# EAGLE design GalvShield_005 (EAGLE 7.1.0)
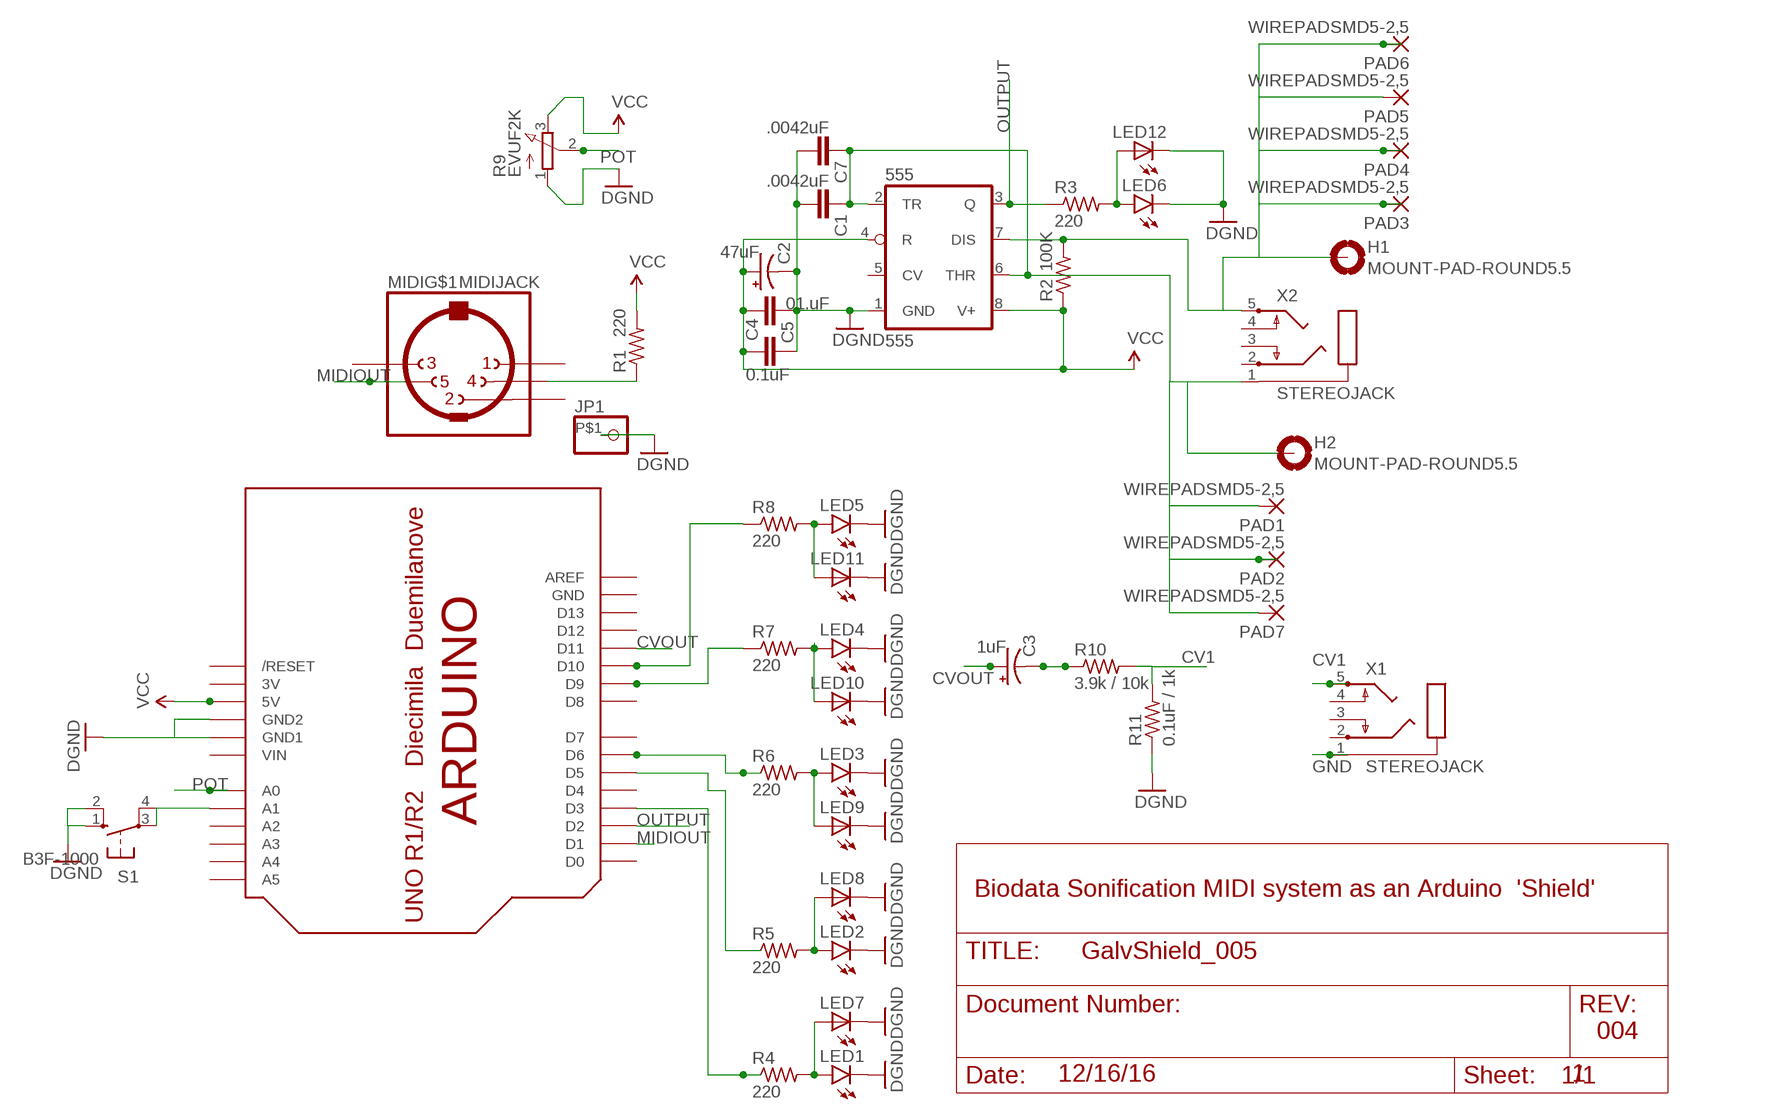
[diagram p0: schematic, sheet 1]

## Parts
555  555  LM555N  [DIL08-ROUND]
C1  .0042uF  CAPPTH  [CAP-PTH-SMALL]
C2  47uF  CAP_POLPTH2  [CPOL-RADIAL-10UF-25V]
C3  1uF  CAP_POLPTH2  [CPOL-RADIAL-10UF-25V]
C4  0.1uF  CAPPTH  [CAP-PTH-SMALL]
C5  01.uF  CAP1206  [1206]
C7  .0042uF  CAP1206  [1206]
H1  MOUNT-PAD-ROUND5.5  [5,5-PAD]
H2  MOUNT-PAD-ROUND5.5  [5,5-PAD]
JP1  PINHD-1X1-BIGPOGO  [1X1-BIGPOGO]
LED1  LED5MM  [LED5MM]
LED2  LED5MM  [LED5MM]
LED3  LED5MM  [LED5MM]
LED4  LED5MM  [LED5MM]
LED5  LED5MM  [LED5MM]
LED6  LED5MM  [LED5MM]
LED7  LEDSML1206  [SML1206]
LED8  LEDSML1206  [SML1206]
LED9  LEDSML1206  [SML1206]
LED10  LEDSML1206  [SML1206]
LED11  LEDSML1206  [SML1206]
LED12  LEDSML1206  [SML1206]
MIDI  MIDIJACK  [CP-2350]
PAD1  WIREPADSMD5-2,5  [5-2,5]
PAD2  WIREPADSMD5-2,5  [5-2,5]
PAD3  WIREPADSMD5-2,5  [5-2,5]
PAD4  WIREPADSMD5-2,5  [5-2,5]
PAD5  WIREPADSMD5-2,5  [5-2,5]
PAD6  WIREPADSMD5-2,5  [5-2,5]
PAD7  WIREPADSMD5-2,5  [5-2,5]
R1  220  R-US_FLIPFLOP7  [0805-THM-7]
R2  100K  R-US_FLIPFLOP7  [0805-THM-7]
R3  220  R-US_FLIPFLOP7  [0805-THM-7]
R4  220  R-US_FLIPFLOP7  [0805-THM-7]
R5  220  R-US_FLIPFLOP7  [0805-THM-7]
R6  220  R-US_FLIPFLOP7  [0805-THM-7]
R7  220  R-US_FLIPFLOP7  [0805-THM-7]
R8  220  R-US_FLIPFLOP7  [0805-THM-7]
R9  EVUF2K  [EVUFXK]
R10  3.9k / 10k  R-US_FLIPFLOP7  [0805-THM-7]
R11  0.1uF / 1k  R-US_FLIPFLOP7  [0805-THM-7]
S1  B3F-1000  10-XX  [B3F-10XX]
U$3  ARDUINOUNO  [ARDUINO]
X1  STEREOJACK  [STX3100]
X2  STEREOJACK  [STX3100]

## Nets
CV1: R10.2 R11.2 X1.5
CVOUT: C3.1(+) U$3.D11
GND: 555.1(GND) C1.2 C2.2(-) C4.2 C5.1 C7.2 JP1.P$1 LED1.K(C) LED2.K(C) LED3.K(C) LED4.K(C) LED5.K(C) LED6.K(C) LED7.C LED8.C LED9.C LED10.C LED11.C LED12.C R9.1(A) R11.1 S1.1(S) S1.2(S1) U$3.GND1 U$3.GND2 X1.1 ; supply symbol labelled DGND
MIDIOUT: MIDI.5 U$3.D1
N$1: C3.2(-) R10.1
N$2: S1.3(P) S1.4(P1) U$3.A1
N$3: R8.1 U$3.D10
N$4: R4.1 U$3.D3
N$5: R5.1 U$3.D5
N$6: MIDI.4 R1.1
N$7: R7.1 U$3.D9
N$10: R6.1 U$3.D6
N$16: LED1.A LED7.A R4.2
N$18: LED2.A LED8.A R5.2
N$19: LED3.A LED9.A R6.2
N$20: LED4.A LED10.A R7.2
N$21: LED5.A LED11.A R8.2
N$26: LED6.A LED12.A R3.2
OUTPUT: 555.3(Q) R3.1 U$3.D2
POT: R9.2(S) U$3.A0
PROBE1: 555.2(TR) 555.6(THR) C1.1 C7.1 H2.B5,5(MOUNT) PAD1.1(P) PAD2.1(P) PAD7.1(P) X2.1
PROBE2: 555.7(DIS) H1.B5,5(MOUNT) PAD3.1(P) PAD4.1(P) PAD5.1(P) PAD6.1(P) R2.2 X2.5
VCC: 555.4(R) 555.8(V+) C2.1(+) C4.1 C5.2 R1.2 R2.1 R9.3(E) U$3.5V
Unconnected: 555.5(CV) MIDI.1 MIDI.2 MIDI.3 MIDI.PE1(MT) MIDI.PE2(MT) MIDI.PE(MT) MIDI.PE@(MT) U$3.A2 U$3.A3 U$3.A4 U$3.A5 U$3.AREF U$3.D0 U$3.D4 U$3.D7 U$3.D8 U$3.D12 U$3.D13 U$3.RESET(/RESET) X1.2 X1.3 X1.4 X2.2 X2.3 X2.4

## Notes on the sheet
- Biodata Sonification MIDI system as an Arduino  'Shield'
- 004
- 12/16/16 | 1

## Power pins joined to a net without a drawn wire
3V: U$3.3V
GND: U$3.GND
VIN: U$3.VIN

## Library data of the parts
555 = adafruit:*555: TIMER Changed DIP package to have round (not oval) pin pads http://www.ladyada.net/library/pcb/eaglelibrary.html
C1 C5 C7 = SparkFun-Passives:CAP: Capacitor Standard 0603 ceramic capacitor, and 0.1" leaded capacitor.
C2 C3 = SparkFun-Passives:CAP_POL: Capacitor Polarized These are standard SMD and PTH capacitors. Normally 10uF, 47uF, and 100uF in electrolytic and tantalum varieties. Always verify the external diameter of the through hole cap, it varies with capacity, voltage, and manufacturer. The EIA devices should be standard.
C4 = SparkFun-Capacitors:CAP: Capacitor Standard 0603 ceramic capacitor, and 0.1" leaded capacitor.
H1 H2 = holes:MOUNT-PAD-ROUND: MOUNTING PAD, round
JP1 = adafruit:PINHD-1X1: Pin header 1x1 for 0.1" spacing With round pins
LED1-LED6 = SparkFun-LED:LED: LEDs Standard schematic elements and footprints for 5mm, 3mm, 1206, and 0603 sized LEDs. 5mm - Spark Fun Electronics SKU : COM-00529 (and others)
LED7-LED12 = led:LED: LED OSRAM: - CHIPLED LG R971, LG N971, LY N971, LG Q971, LY Q971, LO R971, LY R971 LH N974, LH R974 LS Q976, LO Q976, LY Q976 LO Q996 - Hyper CHIPLED LW Q18S LB Q993, LB Q99A, LB R99A - SideLED LS A670, LO A670, LY A670, LG A670, LP A670 LB A673, LV A673, LT A673, LW A673 LH A674 LY A675 LS A676, LA A676, LO A676, LY A676, LW A676 LS A679, LY A679, LG A679 - Hyper Micro SIDELED® LS Y876, LA Y876, LO Y876, LY Y876 LT Y87S - SmartLED LW L88C, LW L88S LB L89C, LB L89S, LG L890 LS L89K, LO L89K, LY L89K LS L896, LA L896, LO L896, LY L896 - TOPLED LS T670, LO T670, LY T670, LG T670, LP T670 LSG T670, LSP T670, LSY T670, LOP T670, LYG T670 LG T671, LOG T671, LSG T671 LB T673, LV T673, LT T673, LW T673 LH T674 LS T676, LA T676, LO T676, LY T676, LB T676, LH T676, LSB T676, LW T676 LB T67C, LV T67C, LT T67C, LS T67K, LO T67K, LY T67K, LW E67C LS E67B, LA E67B, LO E67B, LY E67B, LB E67C, LV E67C, LT E67C LW T67C LS T679, LY T679, LG T679 LS T770, LO T770, LY T770, LG T770, LP T770 LB T773, LV T773, LT T773, LW T773 LH T774 LS E675, LA E675, LY E675, LS T675 LS T776, LA T776, LO T776, LY T776, LB T776 LHGB T686 LT T68C, LB T68C - Hyper Mini TOPLED® LB M676 - Mini TOPLED Santana® LG M470 LS M47K, LO M47K, LY M47K Source: http://www.osram.convergy.de LUXEON: - LUMILED® LXK2-PW12-R00, LXK2-PW12-S00, LXK2-PW14-U00, LXK2-PW14-V00 LXK2-PM12-R00, LXK2-PM12-S00, LXK2-PM14-U00 LXK2-PE12-Q00, LXK2-PE12-R00, LXK2-PE12-S00, LXK2-PE14-T00, LXK2-PE14-U00 LXK2-PB12-K00, LXK2-PB12-L00, LXK2-PB12-M00, LXK2-PB14-N00, LXK2-PB14-P00, LXK2-PB14-Q00 LXK2-PR12-L00, LXK2-PR12-M00, LXK2-PR14-Q00, LXK2-PR14-R00 LXK2-PD12-Q00, LXK2-PD12-R00, LXK2-PD12-S00 LXK2-PH12-R00, LXK2-PH12-S00 LXK2-PL12-P00, LXK2-PL12-Q00, LXK2-PL12-R00 Source: www.luxeon.com KINGBRIGHT: KA-3528ASYC Source: www.kingbright.com
MIDI = adafruit:MIDIJACK: DIN 5 jack also known as MIDI jack A modification of conn-hirshman:MAB5SH with two options for the grounding 'teeth'
PAD1-PAD7 = wirepad:WIREPAD: Wire PAD connect wire on PCB
R1-R8 R10 R11 = adafruit:R-US_: RESISTOR, American symbol
R9 = pot_sam:EVU: 9 mm Square Rotary Potentiometers Source: Panasonic
S1 = switch-omron_circ:10-XX: OMRON SWITCH; MPN: B3F-1000; OC_FARNELL: 176432; OC_NEWARK: 36M3542
U$3 = adafruit:ARDUINO: Arduino Diecimila/Duemilanove Make a shield with ease, this package has all the named pins as well as the two mounting drill holes and an outline of the USB and DC power connector. The outline is on the DIMENSION layer, so if your board house uses it they will cut the outline to match. http://www.ladyada.net/library/pcb/eaglelibrary.html
X1 X2 = adafruit:STEREOJACK: MIC/HEADPHONE JACK Stereo jack with two switches. Kycon STX3100, CUI SJ1-3555NG and/or 4UCon 05544

## Board
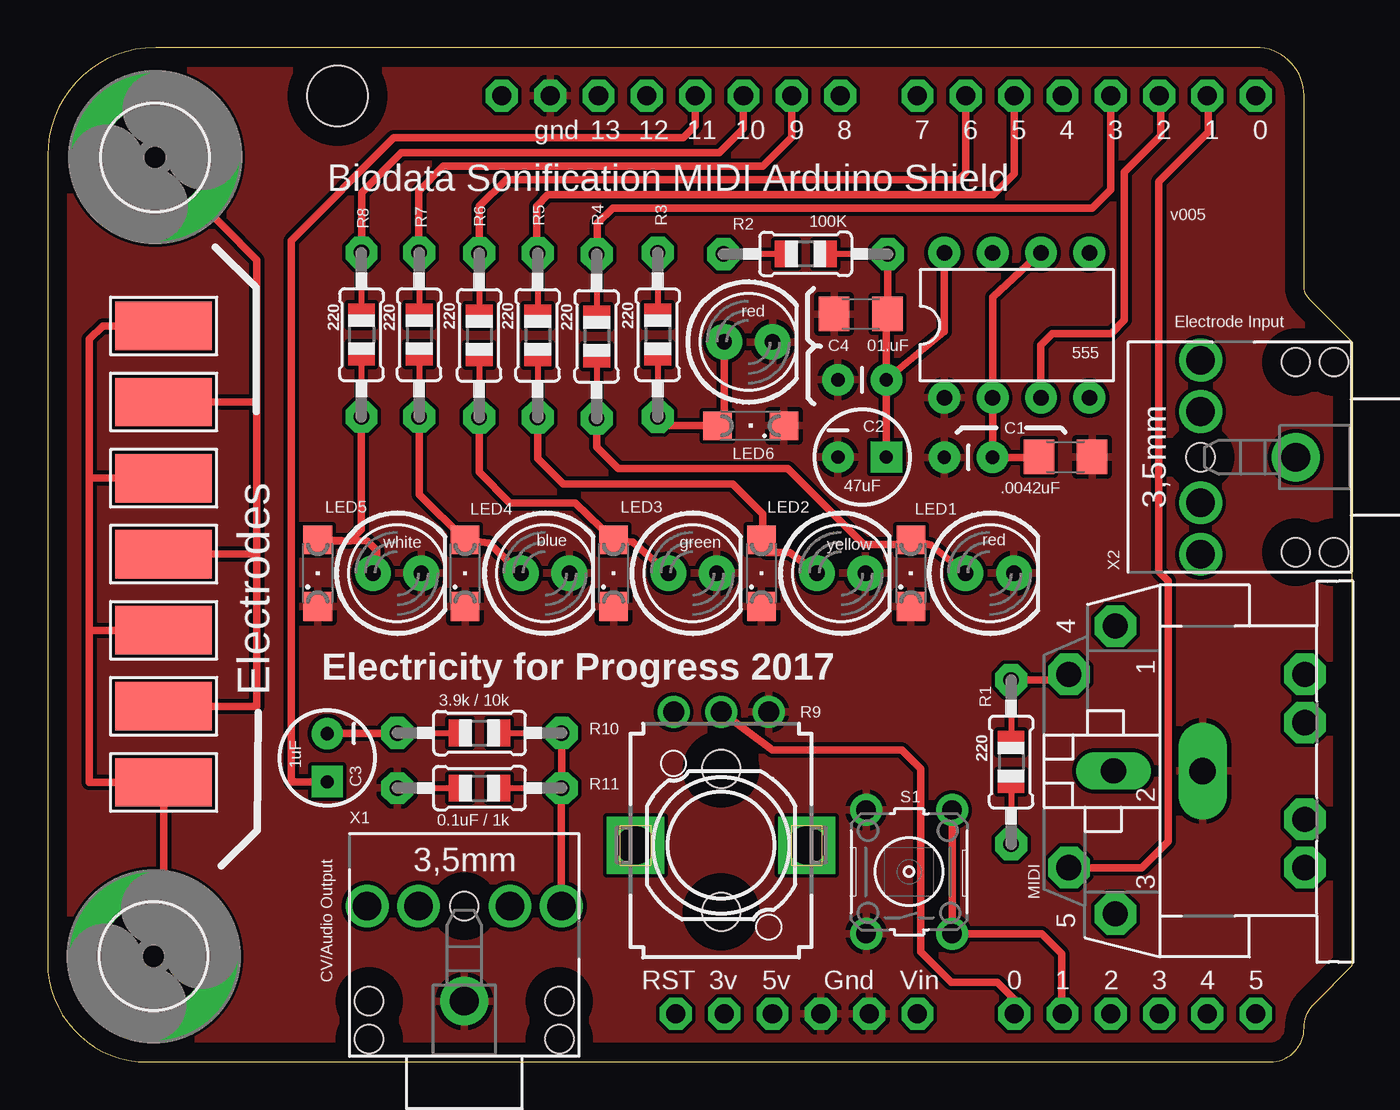
[diagram p1: board, top side]
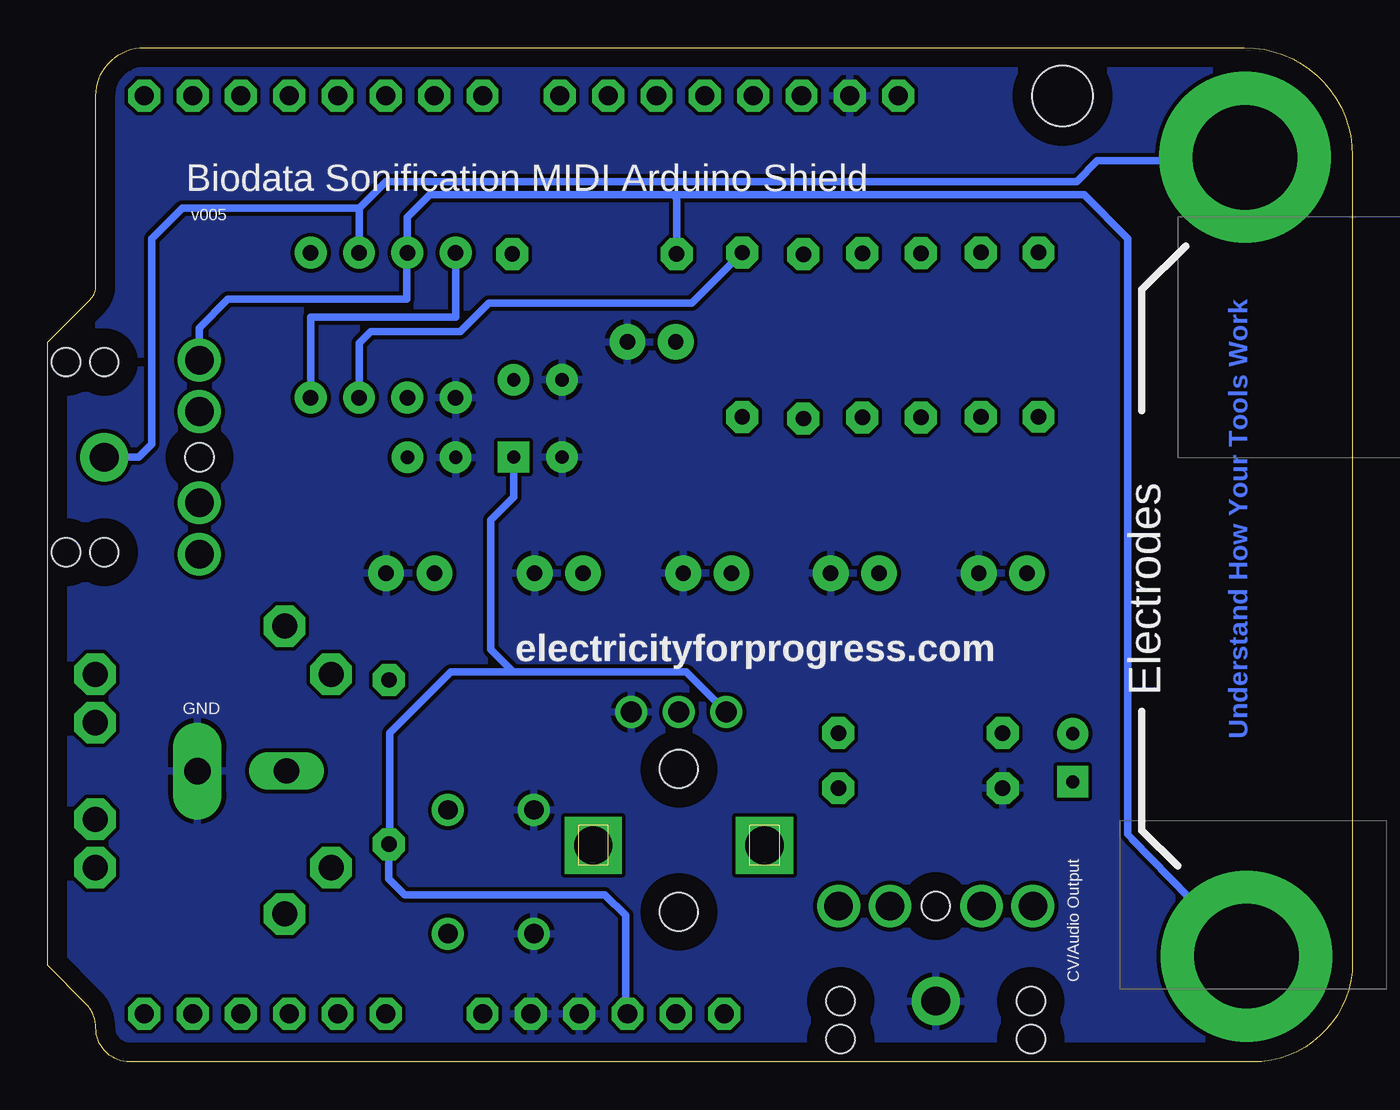
[diagram p2: board, bottom side, seen from below]

Size 68.58 x 53.34 mm. Coordinates in mm from the lower left corner, seen from the top.
Copper layers (1*16): Top 0.035mm / dielectric 1.5mm / Bottom 0.035mm
Design rules "default": minimum track width 10mil, minimum drill 24mil, track to track 8mil, track to pad 8mil, pad to pad 8mil, via to via 8mil, smd to smd 8mil, copper to edge 40mil, drill to drill 8mil, minimum pad ring 10mil, minimum via ring 8mil, stop-mask expansion 4mil, vias tented up to drill 0mil, thermal gap 10mil

### Footprints (pad centres in the part's own frame; a part is rotated, then mirrored left to right if it is on the bottom)
DIL08-ROUND = drill 0.813 pad 1.676: 1 -3.81,-3.81; 2 -1.27,-3.81; 3 1.27,-3.81; 4 3.81,-3.81; 5 3.81,3.81; 6 1.27,3.81; 7 -1.27,3.81; 8 -3.81,3.81
CAP-PTH-SMALL = drill 0.7 pad 1.651: 1 0,0; 2 2.54,0
CPOL-RADIAL-10UF-25V = drill 0.7 pad 1.651 square: 1 1.27,0 | drill 0.7 pad 1.651: 2 -1.27,0
1206 = smd 1.6 x 1.8: 1 -1.4,0; 2 1.4,0
5,5-PAD = drill 5.5 pad 9: B5,5 0,0
1X1-BIGPOGO = drill 1.4 pad 2.54 long: P$1 0,0
LED5MM = drill 0.813 pad 1.88: A -1.27,0; K 1.27,0
SML1206 = smd 1.5 x 1.5: A 1.75,0; C -1.75,0
CP-2350 = drill 1.321 pad 2.184 octagon: 1 7.62,12.58; 3 -7.52,12.58; 4 5.08,15.02; 5 -5.08,15.02; PE -2.54,2.62; PE1 -5.08,2.62; PE2 5.08,2.62; PE@ 2.54,2.62 | drill 1.321 long: 2 0,12.68
5-2,5 = smd 2.54 x 5.08: 1 0,0
0805-THM-7 = drill 0.813 pad 1.676 octagon: 1 -4.318,0; 2 4.318,0
EVUFXK = drill 1.1 pad 1.676: 1 -2.5,-7; 2 0,-7; 3 2.5,-7 | drill 2 pad 2.8 square: M1 4.5,0; M2 -4.5,0 | hole 2: 0,3.5; 0,-4
B3F-10XX = drill 1.016 pad 1.676: 1 -3.251,2.261; 2 3.251,2.261; 3 -3.251,-2.261; 4 3.251,-2.261
ARDUINO = drill 1 pad 1.676 octagon: 3V 35.56,2.54; 5V 38.1,2.54; A0 50.8,2.54; A1 53.34,2.54; A2 55.88,2.54; A3 58.42,2.54; A4 60.96,2.54; A5 63.5,2.54; AREF 23.876,50.8; D0 63.5,50.8; D1 60.96,50.8; D2 58.42,50.8; D3 55.88,50.8; D4 53.34,50.8; D5 50.8,50.8; D6 48.26,50.8; D7 45.72,50.8; D8 41.656,50.8; D9 39.116,50.8; D10 36.576,50.8; D11 34.036,50.8; D12 31.496,50.8; D13 28.956,50.8; GND 26.416,50.8; GND1 43.18,2.54; GND2 40.64,2.54; RESET 33.02,2.54; VIN 45.72,2.54 | hole 3.2: 15.24,50.8
STX3100 = drill 1.5 pad 2.54: 1 2.7,-0.1 | drill 1.5: 2 7.7,5; 3 7.7,2.3; 4 7.7,-2.5; 5 7.7,-5.2 | hole 1.5: 2.7,4.9; 2.7,-5.1; 7.7,-0.1; 0.7,4.9; 0.7,-5.1

### Placement (x,y rotation side)
555  50.94,38.74 0 top
C1  49.67,31.79 180 top
C2  42.81,31.81 0 top
C3  14.7,16 270 top
C4  44.08,35.87 180 top
C5  42.74,39.34 0 top
C7  53.5,31.82 0 top
H1  5.57,5.56 0 top
H2  5.65,47.57 0 top
JP1  60.7,15.3 90 top
LED1  49.52,25.7 0 top
LED2  41.71,25.7 0 top
LED3  33.9,25.7 0 top
LED4  26.15,25.7 0 top
LED5  18.37,25.7 0 top
LED6  36.84,37.86 0 top
LED7  45.37,25.7 90 top
LED8  37.52,25.7 90 top
LED9  29.75,25.7 90 top
LED10  21.94,25.7 90 top
LED11  14.2,25.7 90 top
LED12  36.95,33.46 180 top
MIDI  68.7,15.3 90 top
PAD1  6.1,26.7 90 top
PAD2  6.1,34.7 90 top
PAD3  6.1,30.7 90 top
PAD4  6.1,38.7 90 top
PAD5  6.1,14.7 90 top
PAD6  6.1,22.7 90 top
PAD7  6.1,18.7 90 top
R1  50.64,15.77 270 top
R2  39.84,42.48 180 top
R3  32.07,38.24 270 top
R4  28.86,38.15 270 top
R5  25.76,38.21 270 top
R6  22.68,38.21 270 top
R7  19.53,38.24 270 top
R8  16.5,38.24 270 top
R9  35.4,11.4 180 top
R10  22.7,17.3 0 top
R11  22.7,14.4 0 top
S1  45.28,10 90 top
U$3  0,0 0 top
X1  21.8,0.5 90 top
X2  68.3,31.7 180 top

### Tracks (layer width: path | path; a pad name or v marks a point on that pad's centre or on a via)
CV1
  Top 0.406: R10.2 R11.2 27,14.4 X1.5
CVOUT
  Top 0.406: U$3.D11 34.04,49.24 33.4,48.6 18.2,48.6 12.8,43.2 12.8,14.73 C3.1
GND
  pour Bottom: 0.1,0 65.9,0 65.9,2.6 68.5,5.2 68.5,37.7 65.9,40.3 65.9,51.9 64.4,53.4 0.1,53.3
  pour Top: 0.1,0 65.9,0 65.9,2.2 65.9,2.6 68.5,5.2 68.5,37.7 65.9,40.3 65.9,51.9 64.5,53.3 0.1,53.3
MIDIOUT
  Top 0.406: MIDI.5 57.52,10.22 58.9,11.6 58.9,25.3 58.4,25.8 58.4,46.3 61,48.9 61,50.76 U$3.D1
N$1
  Top 0.406: C3.2 18.38,17.27 R10.1
N$2
  Top 0.406: S1.4 S1.3 52.25,6.75 53.3,5.7 53.3,2.58 U$3.A1
N$3
  Top 0.406: U$3.D10 36.58,49.08 35.3,47.8 18.6,47.8 16.5,45.7 R8.1
N$4
  Top 0.406: U$3.D3 55.88,45.88 54.9,44.9 29.7,44.9 28.9,44.1 28.9,42.51 R4.1
N$5
  Top 0.406: U$3.D5 50.8,46.7 49.7,45.6 26.3,45.6 25.7,45 25.7,42.59 R5.1
N$6
  Top 0.406: R1.1 53.39,20.09 MIDI.4
N$7
  Top 0.406: U$3.D9 39.12,48.62 37.6,47.1 20.8,47.1 19.5,45.8 19.5,42.59 R7.1
N$10
  Top 0.406: U$3.D6 48.26,46.76 47.9,46.4 24.1,46.4 22.7,45 22.7,42.54 R6.1
N$16
  Top 0.406: R4.2 28.86,32.34 30,31.2 38.9,31.2 42.9,27.2 45.36,27.2 LED7.A 46.42,27.19 LED1.A
N$18
  Top 0.406: R5.2 25.76,31.74 27.1,30.4 36,30.4 37.6,28.8 37.6,27.15 | LED2.A 39,26.8 37.8,26.8 37.6,27 37.6,27.15 | 37.6,27.15 LED8.A
N$19
  Top 0.406: R6.2 22.68,31.02 24.3,29.4 27.73,29.4 LED9.A 30.75,27.34 LED3.A
N$20
  Top 0.406: R7.2 19.53,29.84 LED10.A 23.19,27.29 LED4.A
N$21
  Top 0.406: R8.2 16.5,28 15.9,27.4 14.35,27.4 LED11.A 16.81,27.39 17.3,26.9 17.3,25.55 LED5.A
N$26
  Top 0.406: LED6.A 35.56,33.82 LED12.A 32.53,33.46 R3.2
OUTPUT
  Top 0.406: U$3.D2 58.5,50.72 58.5,48.7 56.6,46.8 56.6,39 55.9,38.3 52.81,38.3 52.21,37.7 555.3
  Bottom 0.406: 555.3 52.21,37.79 51.6,38.4 46.9,38.4 45.4,39.9 34.73,39.9 R3.1
POT
  Top 0.406: U$3.A0 50.8,3.3 49.92,4.18 47.5,4.18 45.9,5.78 45.9,15.4 44.9,16.4 38.1,16.4 R9.2
PROBE1
  Top 0.406: 555.6 49.67,40.21 555.2 C1.1 51.67,31.79 C7.1 | 11,34.7 11,42.15 H2.B5,5 | 11,34.7 11,26.9 | 11,26.9 11,18.7 PAD7.1 | PAD2.1 11,34.7 | PAD1.1 10.9,26.7 11,26.9
  Bottom 0.406: 52.2,44.9 50.8,46.3 14.5,46.3 13.4,47.4 6.41,47.4 H2.B5,5 | 52.2,44.9 52.2,42.76 555.6 | X2.1 63.8,31.8 63.1,32.5 63.1,43.3 61.5,44.9 52.2,44.9
PROBE2
  Top 0.406: PAD4.1 2.9,38.7 2.2,38 2.2,30.7 | PAD3.1 2.2,30.7 | 2.2,30.7 2.2,22.7 | 2.2,22.7 PAD6.1 | 2.2,22.7 2.2,14.7 PAD5.1 6.1,6.23 H1.B5,5
  Bottom 0.406: X2.5 60.6,38.6 59.1,40.1 49.7,40.1 49.7,42.75 555.7 49.67,44.43 48.5,45.6 35.7,45.6 | 35.7,45.6 14.1,45.6 11.8,43.3 11.8,11.99 11.57,11.7 H1.B5,5 | R2.2 35.52,45.42 35.7,45.6
VCC
  Top 0.406: C2.1 C4.1 | C4.1 47.13,38.41 555.8 | C4.1 44.08,40.08 C5.2 44.16,40.15 R2.1
  Bottom 0.406: 555.4 54.75,39.16 47.13,39.16 555.8 | C2.1 44.08,29.72 45.3,28.5 45.3,21.7 44.1,20.5 | 44.1,20.5 35,20.5 R9.3 | 44.1,20.5 47.4,20.5 50.6,17.3 50.6,11.49 R1.2 50.64,9.64 49.8,8.8 39.3,8.8 38.2,7.7 38.2,2.64 U$3.5V

### Text on the board
Bottom: Understand How Your Tools Work
tNames: Biodata Sonification MIDI Arduino Shield | v005 | red | Electrode Input | white | blue | green | yellow | red | Electrodes | Electricity for Progress 2017 | R1 | 220 | CV/Audio Output
bNames: Biodata Sonification MIDI Arduino Shield | v005 | electricityforprogress.com | Electrodes | GND | CV/Audio Output
bStop: Understand How Your Tools Work